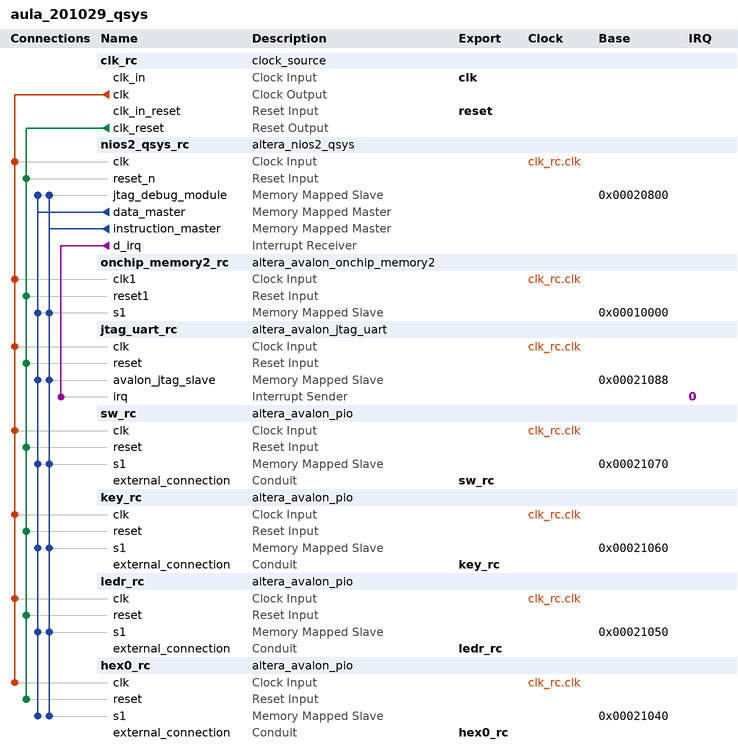
[diagram p0: system contents]
# Platform Designer (Qsys) system aula_201029_qsys, Cyclone II EP2C35F672C6
# Parameters at their usual value, and those the tool derives, are not listed.
package require -exact qsys 13.0.1.99.2
create_system aula_201029_qsys
set_project_property DEVICE_FAMILY {Cyclone II}
set_project_property DEVICE EP2C35F672C6

add_instance clk_rc clock_source 13.0
set_instance_parameter_value clk_rc clockFrequency 50000000

add_instance nios2_qsys_rc altera_nios2_qsys 13.0
set_instance_parameter_value nios2_qsys_rc resetSlave onchip_memory2_rc.s1
set_instance_parameter_value nios2_qsys_rc mmu_TLBMissExcSlave None
set_instance_parameter_value nios2_qsys_rc exceptionSlave onchip_memory2_rc.s1
set_instance_parameter_value nios2_qsys_rc breakSlave nios2_qsys_rc.jtag_debug_module
set_instance_parameter_value nios2_qsys_rc impl Tiny
set_instance_parameter_value nios2_qsys_rc icache_size 4096

add_instance onchip_memory2_rc altera_avalon_onchip_memory2 13.0.1.99.2
set_instance_parameter_value onchip_memory2_rc dataWidth 32
set_instance_parameter_value onchip_memory2_rc dualPort false
set_instance_parameter_value onchip_memory2_rc initMemContent true
set_instance_parameter_value onchip_memory2_rc initializationFileName onchip_mem.hex
set_instance_parameter_value onchip_memory2_rc memorySize 40960

add_instance jtag_uart_rc altera_avalon_jtag_uart 13.0.1.99.2
set_instance_parameter_value jtag_uart_rc simInteractiveOptions NO_INTERACTIVE_WINDOWS

add_instance sw_rc altera_avalon_pio 13.0.1.99.2
set_instance_parameter_value sw_rc direction Input
set_instance_parameter_value sw_rc width 8

add_instance key_rc altera_avalon_pio 13.0.1.99.2
set_instance_parameter_value key_rc direction Input
set_instance_parameter_value key_rc width 4

add_instance ledr_rc altera_avalon_pio 13.0.1.99.2
set_instance_parameter_value ledr_rc direction Output
set_instance_parameter_value ledr_rc width 8

add_instance hex0_rc altera_avalon_pio 13.0.1.99.2
set_instance_parameter_value hex0_rc direction Output
set_instance_parameter_value hex0_rc width 7

# connections
add_connection clk_rc.clk hex0_rc.clk clock
add_connection clk_rc.clk jtag_uart_rc.clk clock
add_connection clk_rc.clk key_rc.clk clock
add_connection clk_rc.clk ledr_rc.clk clock
add_connection clk_rc.clk nios2_qsys_rc.clk clock
add_connection clk_rc.clk onchip_memory2_rc.clk1 clock
add_connection clk_rc.clk sw_rc.clk clock
add_connection clk_rc.clk_reset hex0_rc.reset reset
add_connection clk_rc.clk_reset jtag_uart_rc.reset reset
add_connection clk_rc.clk_reset key_rc.reset reset
add_connection clk_rc.clk_reset ledr_rc.reset reset
add_connection clk_rc.clk_reset nios2_qsys_rc.reset_n reset
add_connection clk_rc.clk_reset onchip_memory2_rc.reset1 reset
add_connection clk_rc.clk_reset sw_rc.reset reset
add_connection nios2_qsys_rc.data_master hex0_rc.s1 avalon
set_connection_parameter_value nios2_qsys_rc.data_master/hex0_rc.s1 baseAddress 0x00021040
add_connection nios2_qsys_rc.data_master jtag_uart_rc.avalon_jtag_slave avalon
set_connection_parameter_value nios2_qsys_rc.data_master/jtag_uart_rc.avalon_jtag_slave baseAddress 0x00021088
add_connection nios2_qsys_rc.data_master key_rc.s1 avalon
set_connection_parameter_value nios2_qsys_rc.data_master/key_rc.s1 baseAddress 0x00021060
add_connection nios2_qsys_rc.data_master ledr_rc.s1 avalon
set_connection_parameter_value nios2_qsys_rc.data_master/ledr_rc.s1 baseAddress 0x00021050
add_connection nios2_qsys_rc.data_master nios2_qsys_rc.jtag_debug_module avalon
set_connection_parameter_value nios2_qsys_rc.data_master/nios2_qsys_rc.jtag_debug_module baseAddress 0x00020800
add_connection nios2_qsys_rc.data_master onchip_memory2_rc.s1 avalon
set_connection_parameter_value nios2_qsys_rc.data_master/onchip_memory2_rc.s1 baseAddress 0x00010000
add_connection nios2_qsys_rc.data_master sw_rc.s1 avalon
set_connection_parameter_value nios2_qsys_rc.data_master/sw_rc.s1 baseAddress 0x00021070
add_connection nios2_qsys_rc.instruction_master hex0_rc.s1 avalon
set_connection_parameter_value nios2_qsys_rc.instruction_master/hex0_rc.s1 baseAddress 0x00021040
add_connection nios2_qsys_rc.instruction_master jtag_uart_rc.avalon_jtag_slave avalon
set_connection_parameter_value nios2_qsys_rc.instruction_master/jtag_uart_rc.avalon_jtag_slave baseAddress 0x00021088
add_connection nios2_qsys_rc.instruction_master key_rc.s1 avalon
set_connection_parameter_value nios2_qsys_rc.instruction_master/key_rc.s1 baseAddress 0x00021060
add_connection nios2_qsys_rc.instruction_master ledr_rc.s1 avalon
set_connection_parameter_value nios2_qsys_rc.instruction_master/ledr_rc.s1 baseAddress 0x00021050
add_connection nios2_qsys_rc.instruction_master nios2_qsys_rc.jtag_debug_module avalon
set_connection_parameter_value nios2_qsys_rc.instruction_master/nios2_qsys_rc.jtag_debug_module baseAddress 0x00020800
add_connection nios2_qsys_rc.instruction_master onchip_memory2_rc.s1 avalon
set_connection_parameter_value nios2_qsys_rc.instruction_master/onchip_memory2_rc.s1 baseAddress 0x00010000
add_connection nios2_qsys_rc.instruction_master sw_rc.s1 avalon
set_connection_parameter_value nios2_qsys_rc.instruction_master/sw_rc.s1 baseAddress 0x00021070
add_connection nios2_qsys_rc.d_irq jtag_uart_rc.irq interrupt
set_connection_parameter_value nios2_qsys_rc.d_irq/jtag_uart_rc.irq irqNumber 0

# exported interfaces
add_interface clk clock sink
set_interface_property clk EXPORT_OF clk_rc.clk_in
add_interface reset reset sink
set_interface_property reset EXPORT_OF clk_rc.clk_in_reset
add_interface sw_rc conduit end
set_interface_property sw_rc EXPORT_OF sw_rc.external_connection
add_interface key_rc conduit end
set_interface_property key_rc EXPORT_OF key_rc.external_connection
add_interface ledr_rc conduit end
set_interface_property ledr_rc EXPORT_OF ledr_rc.external_connection
add_interface hex0_rc conduit end
set_interface_property hex0_rc EXPORT_OF hex0_rc.external_connection

set_interconnect_requirement {$system} qsys_mm.clockCrossingAdapter HANDSHAKE
set_interconnect_requirement {$system} qsys_mm.maxAdditionalLatency 1

save_system aula_201029_qsys.qsys
